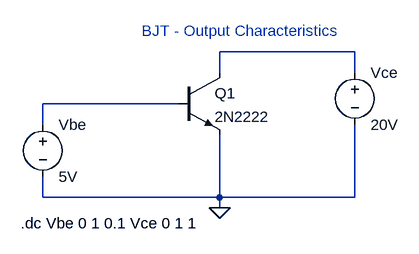
[diagram p0: schematic 5 BJT Characteristics.asc]
5 BJT Characteristics.asc, the LTspice schematic file:
Version 4
SHEET 1 880 680
WIRE 256 32 48 32
WIRE 48 64 48 32
WIRE 256 64 256 32
WIRE -16 112 -224 112
WIRE -224 144 -224 112
WIRE -224 256 -224 224
WIRE 48 256 48 160
WIRE 48 256 -224 256
WIRE 256 256 256 144
WIRE 256 256 48 256
WIRE 48 272 48 256
FLAG 48 272 0
SYMBOL voltage -224 128 R0
WINDOW 123 0 0 Left 0
WINDOW 39 0 0 Left 0
SYMATTR InstName Vbe
SYMATTR Value 5V
SYMBOL npn -16 64 R0
SYMATTR InstName Q1
SYMATTR Value 2N2222
SYMBOL voltage 256 48 R0
WINDOW 123 0 0 Left 0
WINDOW 39 0 0 Left 0
SYMATTR InstName Vce
SYMATTR Value 20V
TEXT -258 296 Left 2 !.dc Vbe 0 1 0.1 Vce 0 1 1
TEXT -72 0 Left 2 ;BJT - Output Characteristics

The netlist it stands for:
* 5 BJT Characteristics.asc
Vbe N002 0 5V
Q1 N001 N002 0 0 2N2222
Vce N001 0 20V
.model NPN NPN
.model PNP PNP
.lib standard.bjt
.dc Vbe 0 1 0.1 Vce 0 1 1
* BJT - Output Characteristics
.backanno
.end